# EasyEDA schematic Nakuja Remix 2.json
TITLE: Sheet_1; REV: 1.0; Date: 2022-04-21; Sheet: 1/1; Drawn By: Rodney Osodo; Company: Your Company
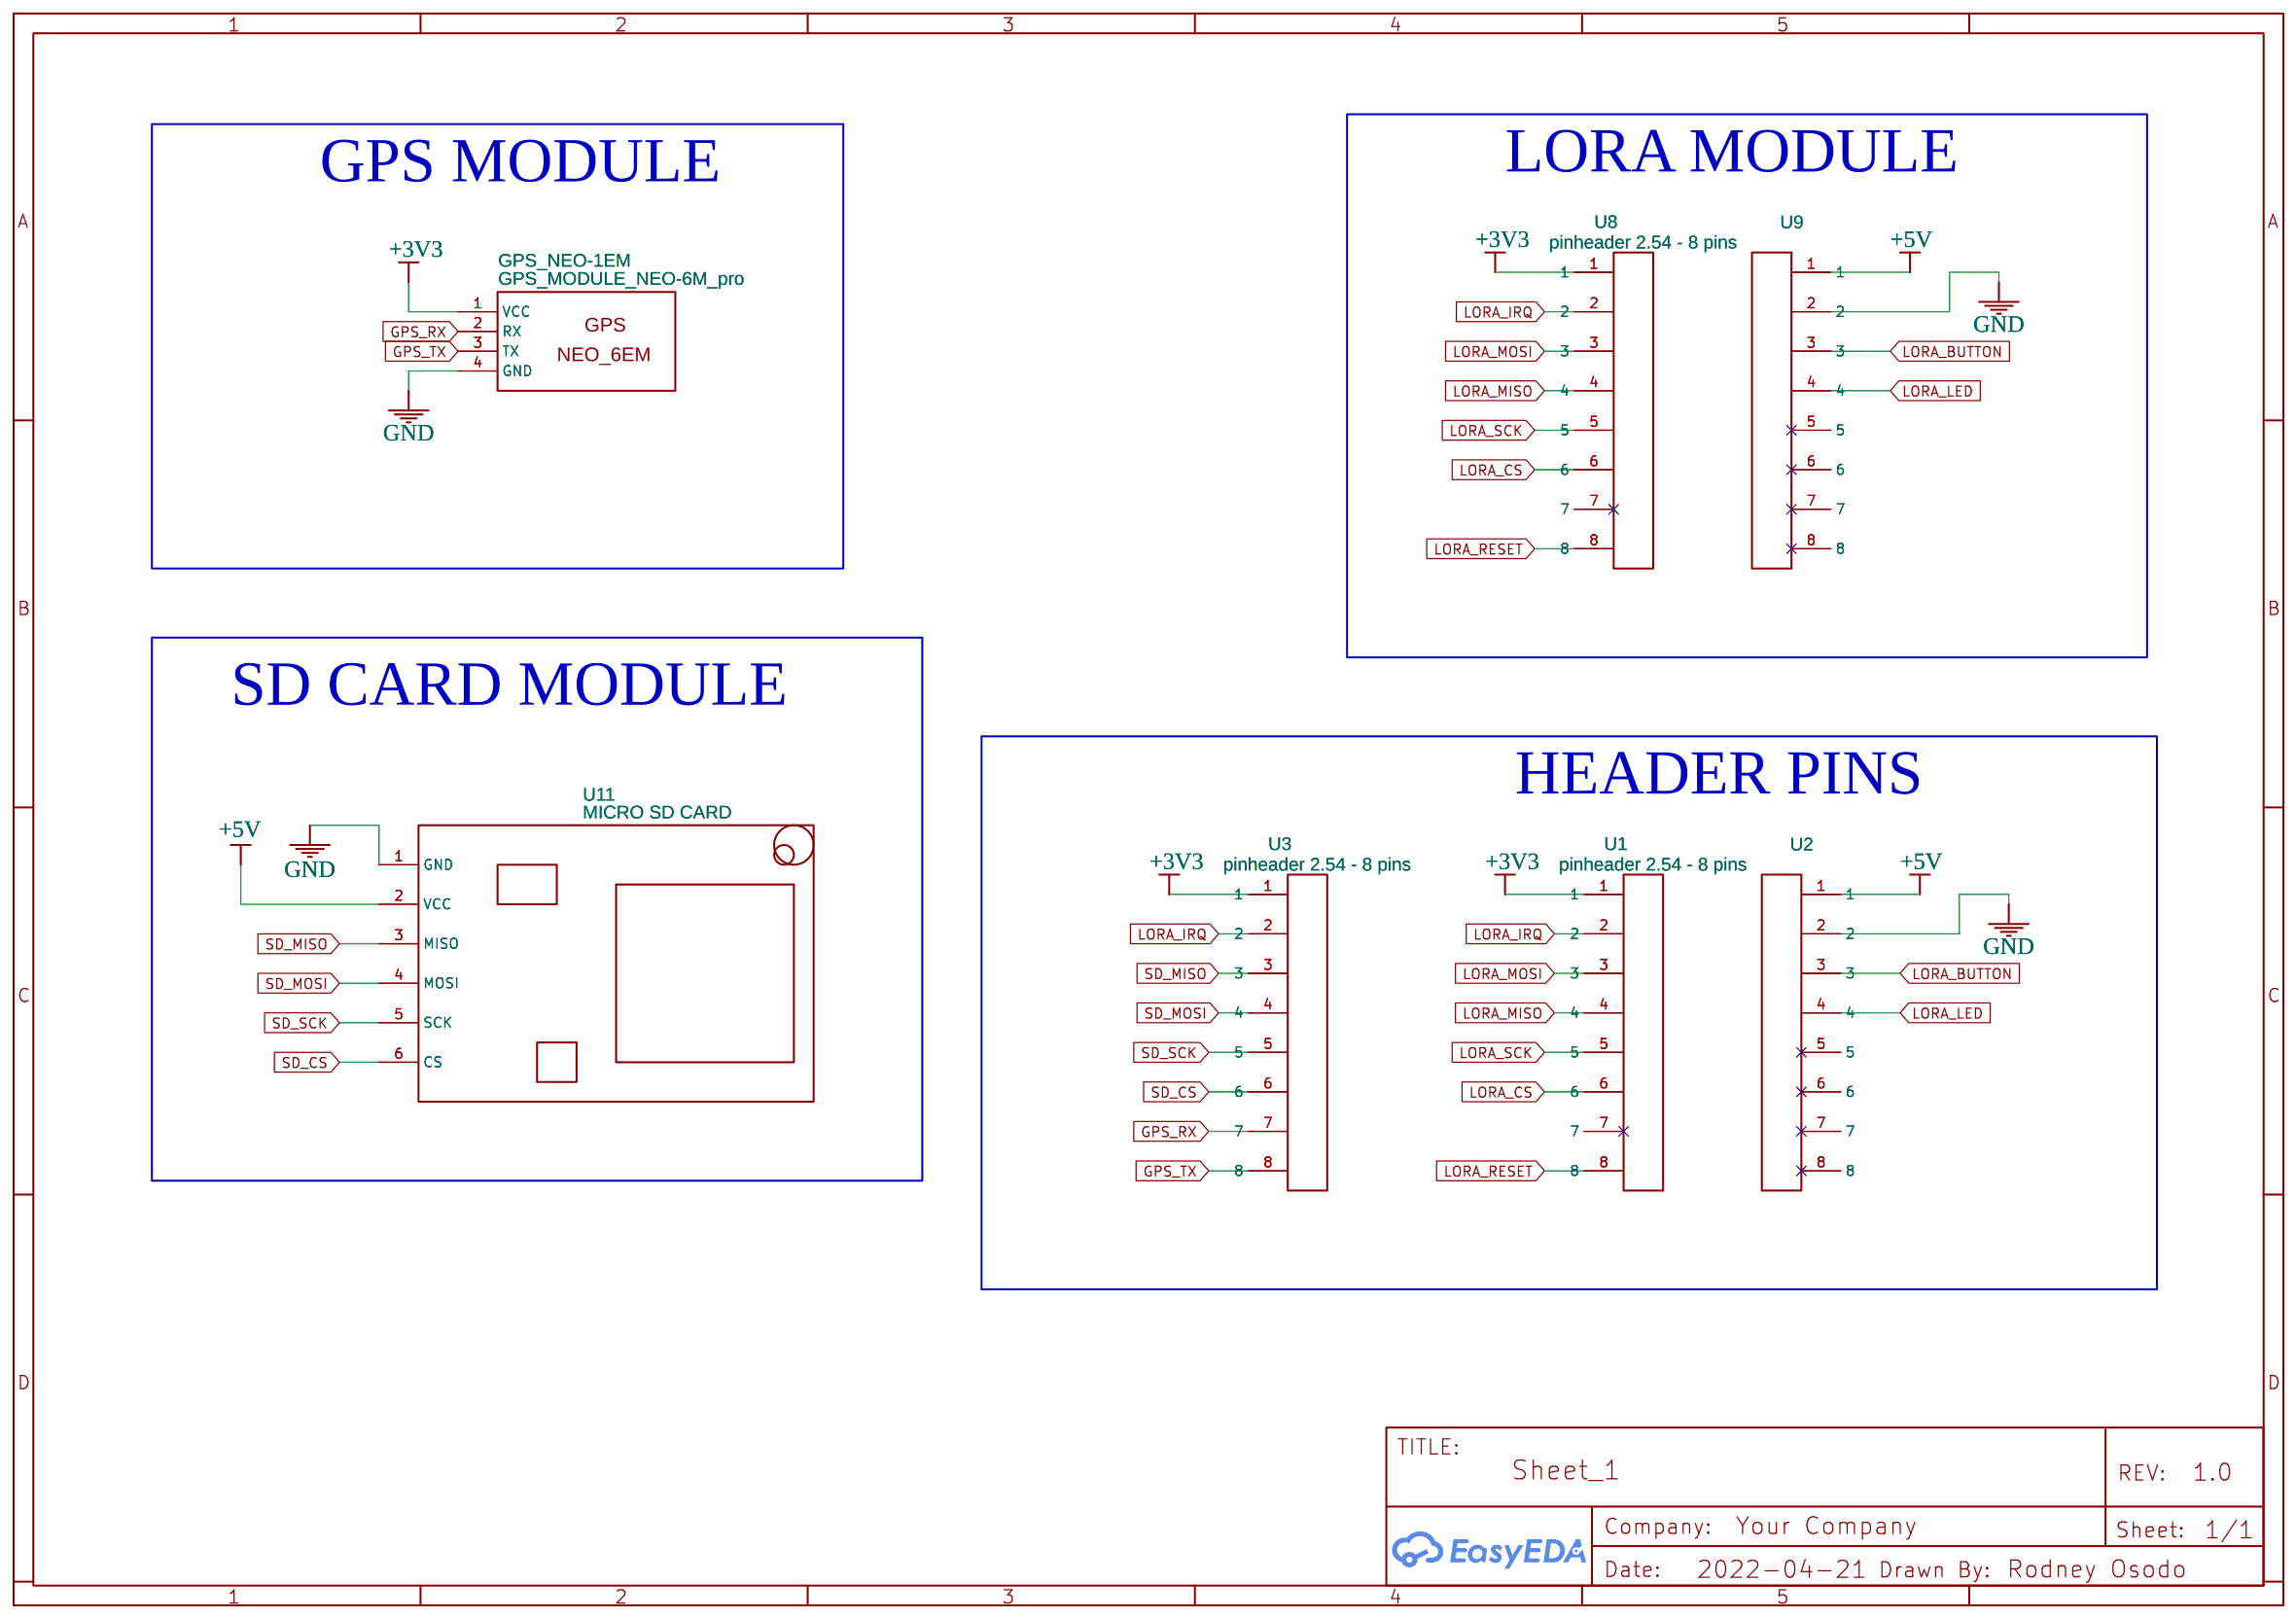
[diagram p0: schematic sheet]

## Parts
GPS_NEO-1EM  GPS_MODULE_NEO-6M_pro  [GPS_MODULE]
U1  pinheader 2.54 - 8 pins  [PINHEADER 2.54 - 8 PINS]
U2  pinheader 2.54 - 8 pins  [PINHEADER 2.54 - 8 PINS]
U3  pinheader 2.54 - 8 pins  [PINHEADER 2.54 - 8 PINS]
U8  pinheader 2.54 - 8 pins  [PINHEADER 2.54 - 8 PINS]
U9  pinheader 2.54 - 8 pins  [PINHEADER 2.54 - 8 PINS]
U11  MICRO SD CARD  [MICRO SD CARD]

## Library data of the parts
GPS_NEO-1EM = GPS_MODULE_NEO-6M_pro: Contributor: Sanchezz2; sourceId: cy4mEWdvN
U1-U3 U8 U9 = pinheader 2.54 - 8 pins: Contributor: pramodsreelakam
U11 = MICRO SD CARD: Supplier: RS-Online; Contributor: SRY TIS

## Nets
+3V3: GPS_NEO-1EM.1(VCC) U1.1 U3.1 U8.1
+5V: U2.1 U9.1 U11.2(VCC)
GND: GPS_NEO-1EM.4(GND) U2.2 U9.2 U11.1(GND)
GPS_RX: GPS_NEO-1EM.2(RX) U3.7
GPS_TX: GPS_NEO-1EM.3(TX) U3.8
LORA_BUTTON: U2.3 U9.3
LORA_CS: U1.6 U8.6
LORA_IRQ: U1.2 U3.2 U8.2
LORA_LED: U2.4 U9.4
LORA_MISO: U1.4 U8.4
LORA_MOSI: U1.3 U8.3
LORA_RESET: U1.8 U8.8
LORA_SCK: U1.5 U8.5
SD_CS: U3.6 U11.6(CS)
SD_MISO: U3.3 U11.3(MISO)
SD_MOSI: U3.4 U11.4(MOSI)
SD_SCK: U3.5 U11.5(SCK)

Not connected (* = marked no-connect by the designer): U1 7*; U2 5* 6* 7* 8*; U8 7*; U9 5* 6* 7* 8*

## Notes on the sheet
- LORA MODULE
- GPS MODULE
- SD CARD MODULE
- HEADER PINS
